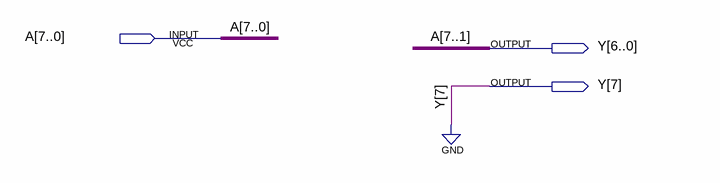
[diagram p0: schematic sheet]
// Quartus schematic 1BitRigthShift.bdf as structural Verilog: 0 symbols, 3 pins
module \1BitRigthShift  (
  input  [7:0] A,
  output [7:0] Y
);


  assign Y = {1'b0, A[7:1]};
endmodule
